# Altium schematic sheet 风火轮（单面）.SchDoc
size A3
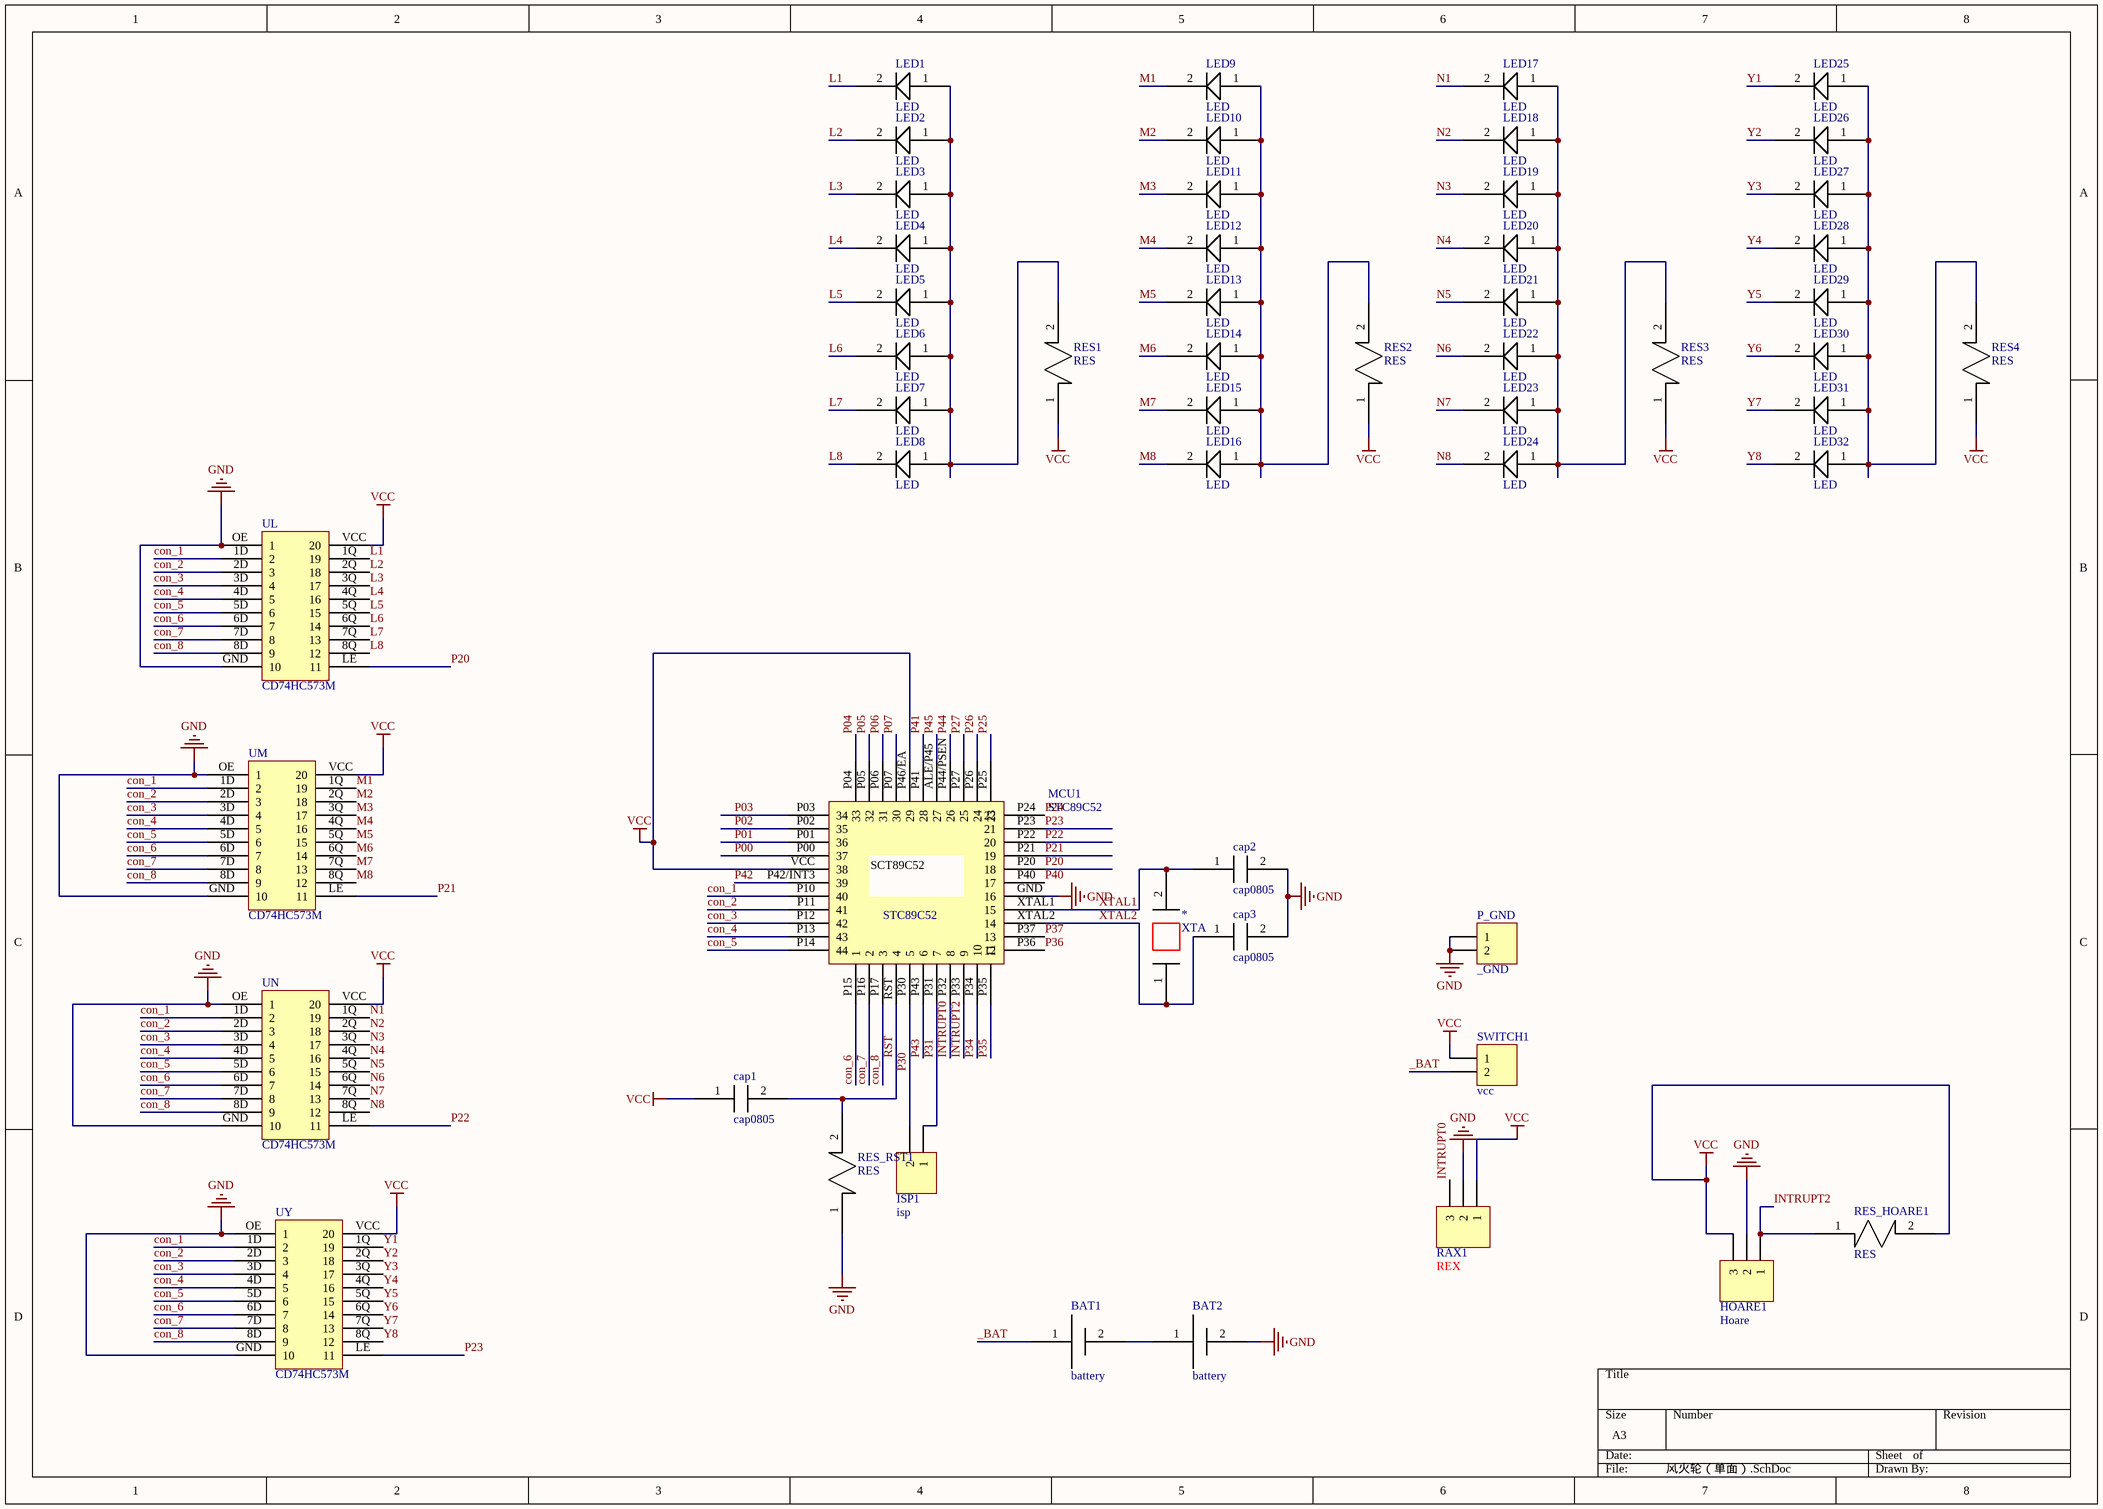
[diagram p0: 风火轮（单面）.SchDoc]

## Parts
*  XTA  [TIMER]
BAT1  battery  [纽扣电池]
BAT2  battery  [纽扣电池]
cap1  cap0805  [0805（1）]
cap2  cap0805  [0805（1）]
cap3  cap0805  [0805（1）]
HOARE1  Hoare  [HDR1X3]
ISP1  isp  [HDR1X2]
LED1  LED  [0805（1）]
LED2  LED  [0805（1）]
LED3  LED  [0805（1）]
LED4  LED  [0805（1）]
LED5  LED  [0805（1）]
LED6  LED  [0805（1）]
LED7  LED  [0805（1）]
LED8  LED  [0805（1）]
LED9  LED  [0805（1）]
LED10  LED  [0805（1）]
LED11  LED  [0805（1）]
LED12  LED  [0805（1）]
LED13  LED  [0805（1）]
LED14  LED  [0805（1）]
LED15  LED  [0805（1）]
LED16  LED  [0805（1）]
LED17  LED  [0805（1）]
LED18  LED  [0805（1）]
LED19  LED  [0805（1）]
LED20  LED  [0805（1）]
LED21  LED  [0805（1）]
LED22  LED  [0805（1）]
LED23  LED  [0805（1）]
LED24  LED  [0805（1）]
LED25  LED  [0805（1）]
LED26  LED  [0805（1）]
LED27  LED  [0805（1）]
LED28  LED  [0805（1）]
LED29  LED  [0805（1）]
LED30  LED  [0805（1）]
LED31  LED  [0805（1）]
LED32  LED  [0805（1）]
MCU1  STC89C52  [QFP127P600-8N_LQFP889C52]
P_GND  _GND  [HDR1X2]
RAX1  REX  [HDR1X3]
RES1  RES  [0805（1）]
RES2  RES  [0805（1）]
RES3  RES  [0805（1）]
RES4  RES  [0805（1）]
RES_HOARE1  RES  [0805（1）]
RES_RST1  RES  [0805（1）]
SWITCH1  vcc  [HDR1X2]
UL  CD74HC573M  [SOIC127P1030X265-20N_CD74HC573M_SOIC]
UM  CD74HC573M  [SOIC127P1030X265-20N_CD74HC573M_SOIC]
UN  CD74HC573M  [SOIC127P1030X265-20N_CD74HC573M_SOIC]
UY  CD74HC573M  [SOIC127P1030X265-20N_CD74HC573M_SOIC]

## Nets
GND: BAT2.2 cap2.2 cap3.2 HOARE1.2 MCU1.GND(16) P_GND.1 P_GND.2 RAX1.2 RES_RST1.1 UL.GND(10) UL.OE(1) UM.GND(10) UM.OE(1) UN.GND(10) UN.OE(1) UY.GND(10) UY.OE(1)
VCC: cap1.1 HOARE1.3 MCU1.P46/EA(29) MCU1.VCC(38) RAX1.1 RES1.1 RES2.1 RES3.1 RES4.1 RES_HOARE1.2 SWITCH1.1 UL.VCC(20) UM.VCC(20) UN.VCC(20) UY.VCC(20)
_BAT: BAT1.1 SWITCH1.2
con_1: MCU1.P10(40) UL.1D(2) UM.1D(2) UN.1D(2) UY.1D(2)
con_2: MCU1.P11(41) UL.2D(3) UM.2D(3) UN.2D(3) UY.2D(3)
con_3: MCU1.P12(42) UL.3D(4) UM.3D(4) UN.3D(4) UY.3D(4)
con_4: MCU1.P13(43) UL.4D(5) UM.4D(5) UN.4D(5) UY.4D(5)
con_5: MCU1.P14(44) UL.5D(6) UM.5D(6) UN.5D(6) UY.5D(6)
con_6: MCU1.P15(1) UL.6D(7) UM.6D(7) UN.6D(7) UY.6D(7)
con_7: MCU1.P16(2) UL.7D(8) UM.7D(8) UN.7D(8) UY.7D(8)
con_8: MCU1.P17(3) UL.8D(9) UM.8D(9) UN.8D(9) UY.8D(9)
INTRUPT0: MCU1.P32(8) RAX1.3
INTRUPT2: HOARE1.1 MCU1.P33(9) RES_HOARE1.1
L1: LED1.2 UL.1Q(19)
L2: LED2.2 UL.2Q(18)
L3: LED3.2 UL.3Q(17)
L4: LED4.2 UL.4Q(16)
L5: LED5.2 UL.5Q(15)
L6: LED6.2 UL.6Q(14)
L7: LED7.2 UL.7Q(13)
L8: LED8.2 UL.8Q(12)
M1: LED9.2 UM.1Q(19)
M2: LED10.2 UM.2Q(18)
M3: LED11.2 UM.3Q(17)
M4: LED12.2 UM.4Q(16)
M5: LED13.2 UM.5Q(15)
M6: LED14.2 UM.6Q(14)
M7: LED15.2 UM.7Q(13)
M8: LED16.2 UM.8Q(12)
N1: LED17.2 UN.1Q(19)
N2: LED18.2 UN.2Q(18)
N3: LED19.2 UN.3Q(17)
N4: LED20.2 UN.4Q(16)
N5: LED21.2 UN.5Q(15)
N6: LED22.2 UN.6Q(14)
N7: LED23.2 UN.7Q(13)
N8: LED24.2 UN.8Q(12)
P00: MCU1.P00(37)
P01: MCU1.P01(36)
P02: MCU1.P02(35)
P03: MCU1.P03(34)
P04: MCU1.P04(33)
P05: MCU1.P05(32)
P06: MCU1.P06(31)
P07: MCU1.P07(30)
P20: MCU1.P20(18) UL.LE(11)
P21: MCU1.P21(19) UM.LE(11)
P22: MCU1.P22(20) UN.LE(11)
P23: MCU1.P23(21) UY.LE(11)
P24: MCU1.P24(22)
P25: MCU1.P25(23)
P26: MCU1.P26(24)
P27: MCU1.P27(25)
P30: ISP1.2 MCU1.P30(5)
P31: ISP1.1 MCU1.P31(7)
P34: MCU1.P34(10)
P35: MCU1.P35(11)
P36: MCU1.P36(12)
P37: MCU1.P37(13)
P40: MCU1.P40(17)
P41: MCU1.P41(28)
P42: MCU1.P42/INT3(39)
P43: MCU1.P43(6)
P44: MCU1.P44/PSEN(26)
P45: MCU1.ALE/P45(27)
RST: cap1.2 MCU1.RST(4) RES_RST1.2
XTAL1: *.2 cap2.1 MCU1.XTAL1(15)
XTAL2: *.1 cap3.1 MCU1.XTAL2(14)
Y1: LED25.2 UY.1Q(19)
Y2: LED26.2 UY.2Q(18)
Y3: LED27.2 UY.3Q(17)
Y4: LED28.2 UY.4Q(16)
Y5: LED29.2 UY.5Q(15)
Y6: LED30.2 UY.6Q(14)
Y7: LED31.2 UY.7Q(13)
Y8: LED32.2 UY.8Q(12)
NetBAT1_2: BAT1.2 BAT2.1
NetLED1_1: LED1.1 LED2.1 LED3.1 LED4.1 LED5.1 LED6.1 LED7.1 LED8.1 RES1.2
NetLED9_1: LED9.1 LED10.1 LED11.1 LED12.1 LED13.1 LED14.1 LED15.1 LED16.1 RES2.2
NetLED17_1: LED17.1 LED18.1 LED19.1 LED20.1 LED21.1 LED22.1 LED23.1 LED24.1 RES3.2
NetLED25_1: LED25.1 LED26.1 LED27.1 LED28.1 LED29.1 LED30.1 LED31.1 LED32.1 RES4.2

## Notes on the sheet
- (in symbol STC89C52) SCT89C52 /

## Library data of the parts
BAT1 BAT2 = battery: pin to pad: 1>A 2>K
cap1-cap3 = cap0805: pin to pad: 1>K 2>A
HOARE1 RAX1 = Header 3: Header, 3-Pin; LatestRevisionDate: 17-Jul-2002; LatestRevisionNote: Re-released for DXP Platform.; Publisher: Altium Limited
ISP1 P_GND SWITCH1 = Header 2: Header, 2-Pin; LatestRevisionDate: 17-Jul-2002; LatestRevisionNote: Re-released for DXP Platform.; Publisher: Altium Limited
LED1-LED32 = led0805: pin to pad: 1>A 2>K
MCU1 = STC89C52: pin to pad: ALE/P45>27 GND>16 P00>37 P01>36 P02>35 P03>34 P04>33 P05>32 P06>31 P07>30 P10>40 P11>41 P12>42 P13>43 P14>44 P15>1 P16>2 P17>3 P20>18 P21>19 P22>20 P23>21 P24>22 P25>23 P26>24 P27>25 P30>5 P31>7 P32>8 P33>9 P34>10 P35>11 P36>12 P37>13 P40>17 P41>28 P42/INT3>39 P43>6 P44/PSEN>26 P46/EA>29 RST>4 VCC>38 XTAL1>15 XTAL2>14
RES1-RES4 RES_HOARE1 RES_RST1 = res0805: pin to pad: 1>A 2>K
UL UM UN UY = CD74HC573M: pin to pad: 1D>2 1Q>19 2D>3 2Q>18 3D>4 3Q>17 4D>5 4Q>16 5D>6 5Q>15 6D>7 6Q>14 7D>8 7Q>13 8D>9 8Q>12 GND>10 LE>11 OE>1 VCC>20